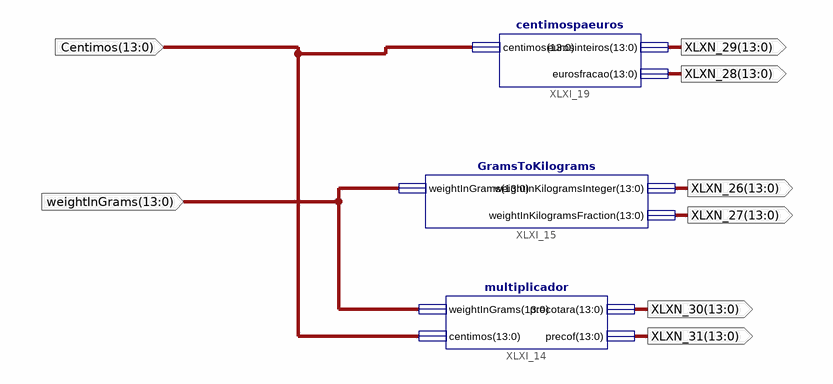
[diagram p0: schematic sheet 1]
// Xilinx ISE schematic esquemageral.sch (artix7) as structural Verilog: 3 symbols, 8 ports
module esquemageral (
  input  [13:0] Centimos,
  input  [13:0] weightInGrams,
  output [13:0] XLXN_26,
  output [13:0] XLXN_27,
  output [13:0] XLXN_28,
  output [13:0] XLXN_29,
  output [13:0] XLXN_30,
  output [13:0] XLXN_31
);

  multiplicador XLXI_14 (.weightInGrams(weightInGrams), .centimos(Centimos), .precotara(XLXN_30), .precof(XLXN_31));
  GramsToKilograms XLXI_15 (
    .weightInGrams(weightInGrams), .weightInKilogramsInteger(XLXN_26), .weightInKilogramsFraction(XLXN_27));
  centimospaeuros XLXI_19 (.centimos(Centimos), .eurosinteiros(XLXN_29), .eurosfracao(XLXN_28));
endmodule
